# Altium schematic sheet security-accelerometer.SchDoc
size A
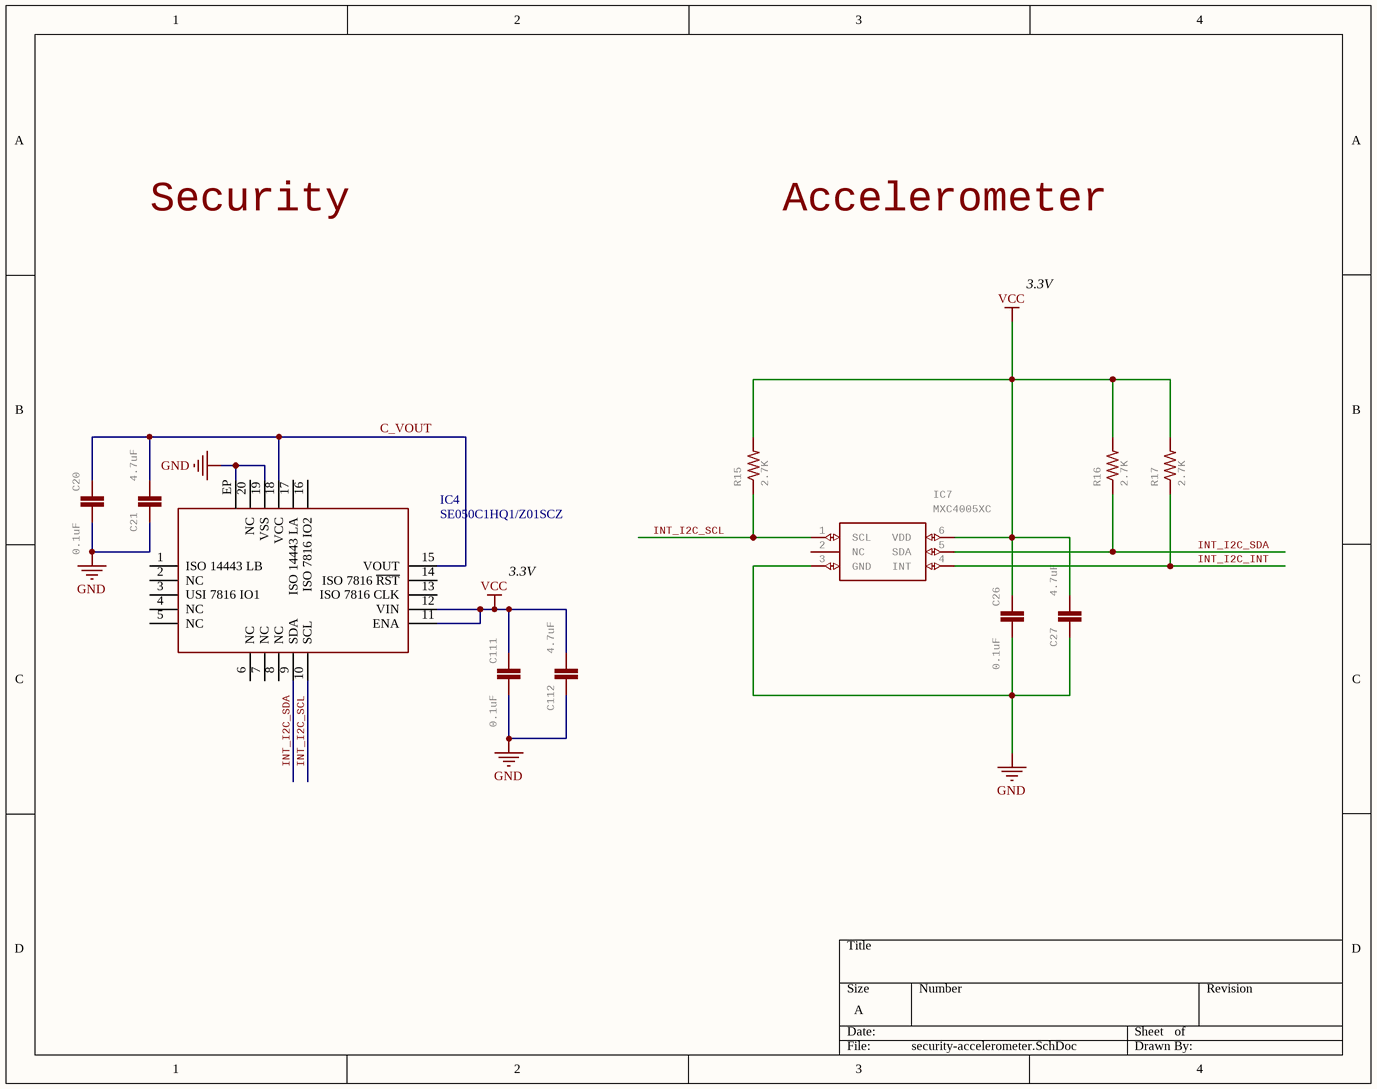
[diagram p0: security-accelerometer.SchDoc]

## Parts
C20  0.1uF  [0402-CAP]
C21  4.7uF  [0402-CAP]
C26  0.1uF  [0402-CAP]
C27  4.7uF  [0402-CAP]
C111  0.1uF  [0402-CAP]
C112  4.7uF  [0402-CAP]
IC4  SE050C1HQ1/Z01SCZ  [HX2QFN20]
IC7  MXC4005XC  [MXC4005XC]
R15  2.7K  [0402-RES]
R16  2.7K  [0402-RES]
R17  2.7K  [0402-RES]

## Nets
GND: C20.2 C21.1 C26.2 C27.1 C111.2 C112.1 IC4.19(VSS) IC4.EP IC7.3(GND)
VCC: C26.1 C27.2 C111.1 C112.2 IC4.11(ENA) IC4.12(VIN) IC7.6(VDD) R15.2 R16.2 R17.2
C_VOUT: C20.1 C21.2 IC4.15(VOUT) IC4.18(VCC)
INT_I2C_INT: IC7.4(INT) R17.1
INT_I2C_SCL: IC4.10(SCL) IC7.1(SCL) R15.1
INT_I2C_SDA: IC4.9(SDA) IC7.5(SDA) R16.1

Not connected (* = marked no-connect by the designer): IC4 1(ISO_14443_LB) 2(NC) 3(USI_7816_IO1) 4(NC) 5(NC) 6(NC) 7(NC) 8(NC) 13(ISO_7816_CLK) 14(ISO_7816_~{RST}) 16(ISO_7816_IO2) 17(ISO_14443_LA) 20(NC); IC7 2(NC)

## Notes on the sheet
- Security
- Accelerometer
- 3.3V

## Library data of the parts
C20 C26 C111 = C-EUC0201: CAPACITOR, European symbol; MPN: C0402C104Z4VAC; GateName_1: G$1; SymbolName_1: C-EU; POPULARITY: 0; LibraryName: rcl; DeviceSetName: C-EU; SPICEPREFIX: C; Part Number: C0402C104Z4VAC
C21 C27 C112 = CAP0402-CAP: CapacitorStandard 0603 ceramic capacitor, and 0.1" leaded capacitor.; MPN: JMK105BBJ475MV-F; GateName_1: G$1; SymbolName_1: CAP; DeviceName: 0402-CAP; LibraryName: sfe; DeviceSetName: CAP; Part Number: JMK105BBJ475MV-F
IC7 = MXC4005XC: Accelerometers Monolithic and Wafer Level Packaged Three-Axis Accelerometer   Source:  Datasheet; MANUFACTURER_NAME: MEMSIC; GateName_1: G$1; SymbolName_1: MXC4005XC; LibraryName: MXC4005XC; DeviceSetName: MXC4005XC; HEIGHT: 0.885mm; MANUFACTURER_PART_NUMBER: MXC4005XC; MOUSER_PART_NUMBER: 438-MXC4005XC; MOUSER_PRICE-STOCK: https://www.mouser.co.uk/ProductDetail/MEMSIC/MXC4005XC?qs=RcG8xmE7yp3iyYgWLmAtUw%3D%3D; MPN: MXC4005XC; Part Number: MXC4005XC
R15-R17 = RESISTOR0402-RES: ResistorBasic schematic elements and footprints for 0603, 1206, and PTH resistors.; MPN: AC0402JR-072K7L; GateName_1: G$1; SymbolName_1: RESISTOR; DeviceName: 0402-RES; LibraryName: sfe; DeviceSetName: RESISTOR; Part Number: AC0402JR-072K7L
IC4 = SE050C1HQ1/Z01SCZ: Part Number: SE050C1HQ1/Z01SCZ; MPN: SE050C1HQ1/Z01SCZ